# Altium project EasySerial.PrjPcb
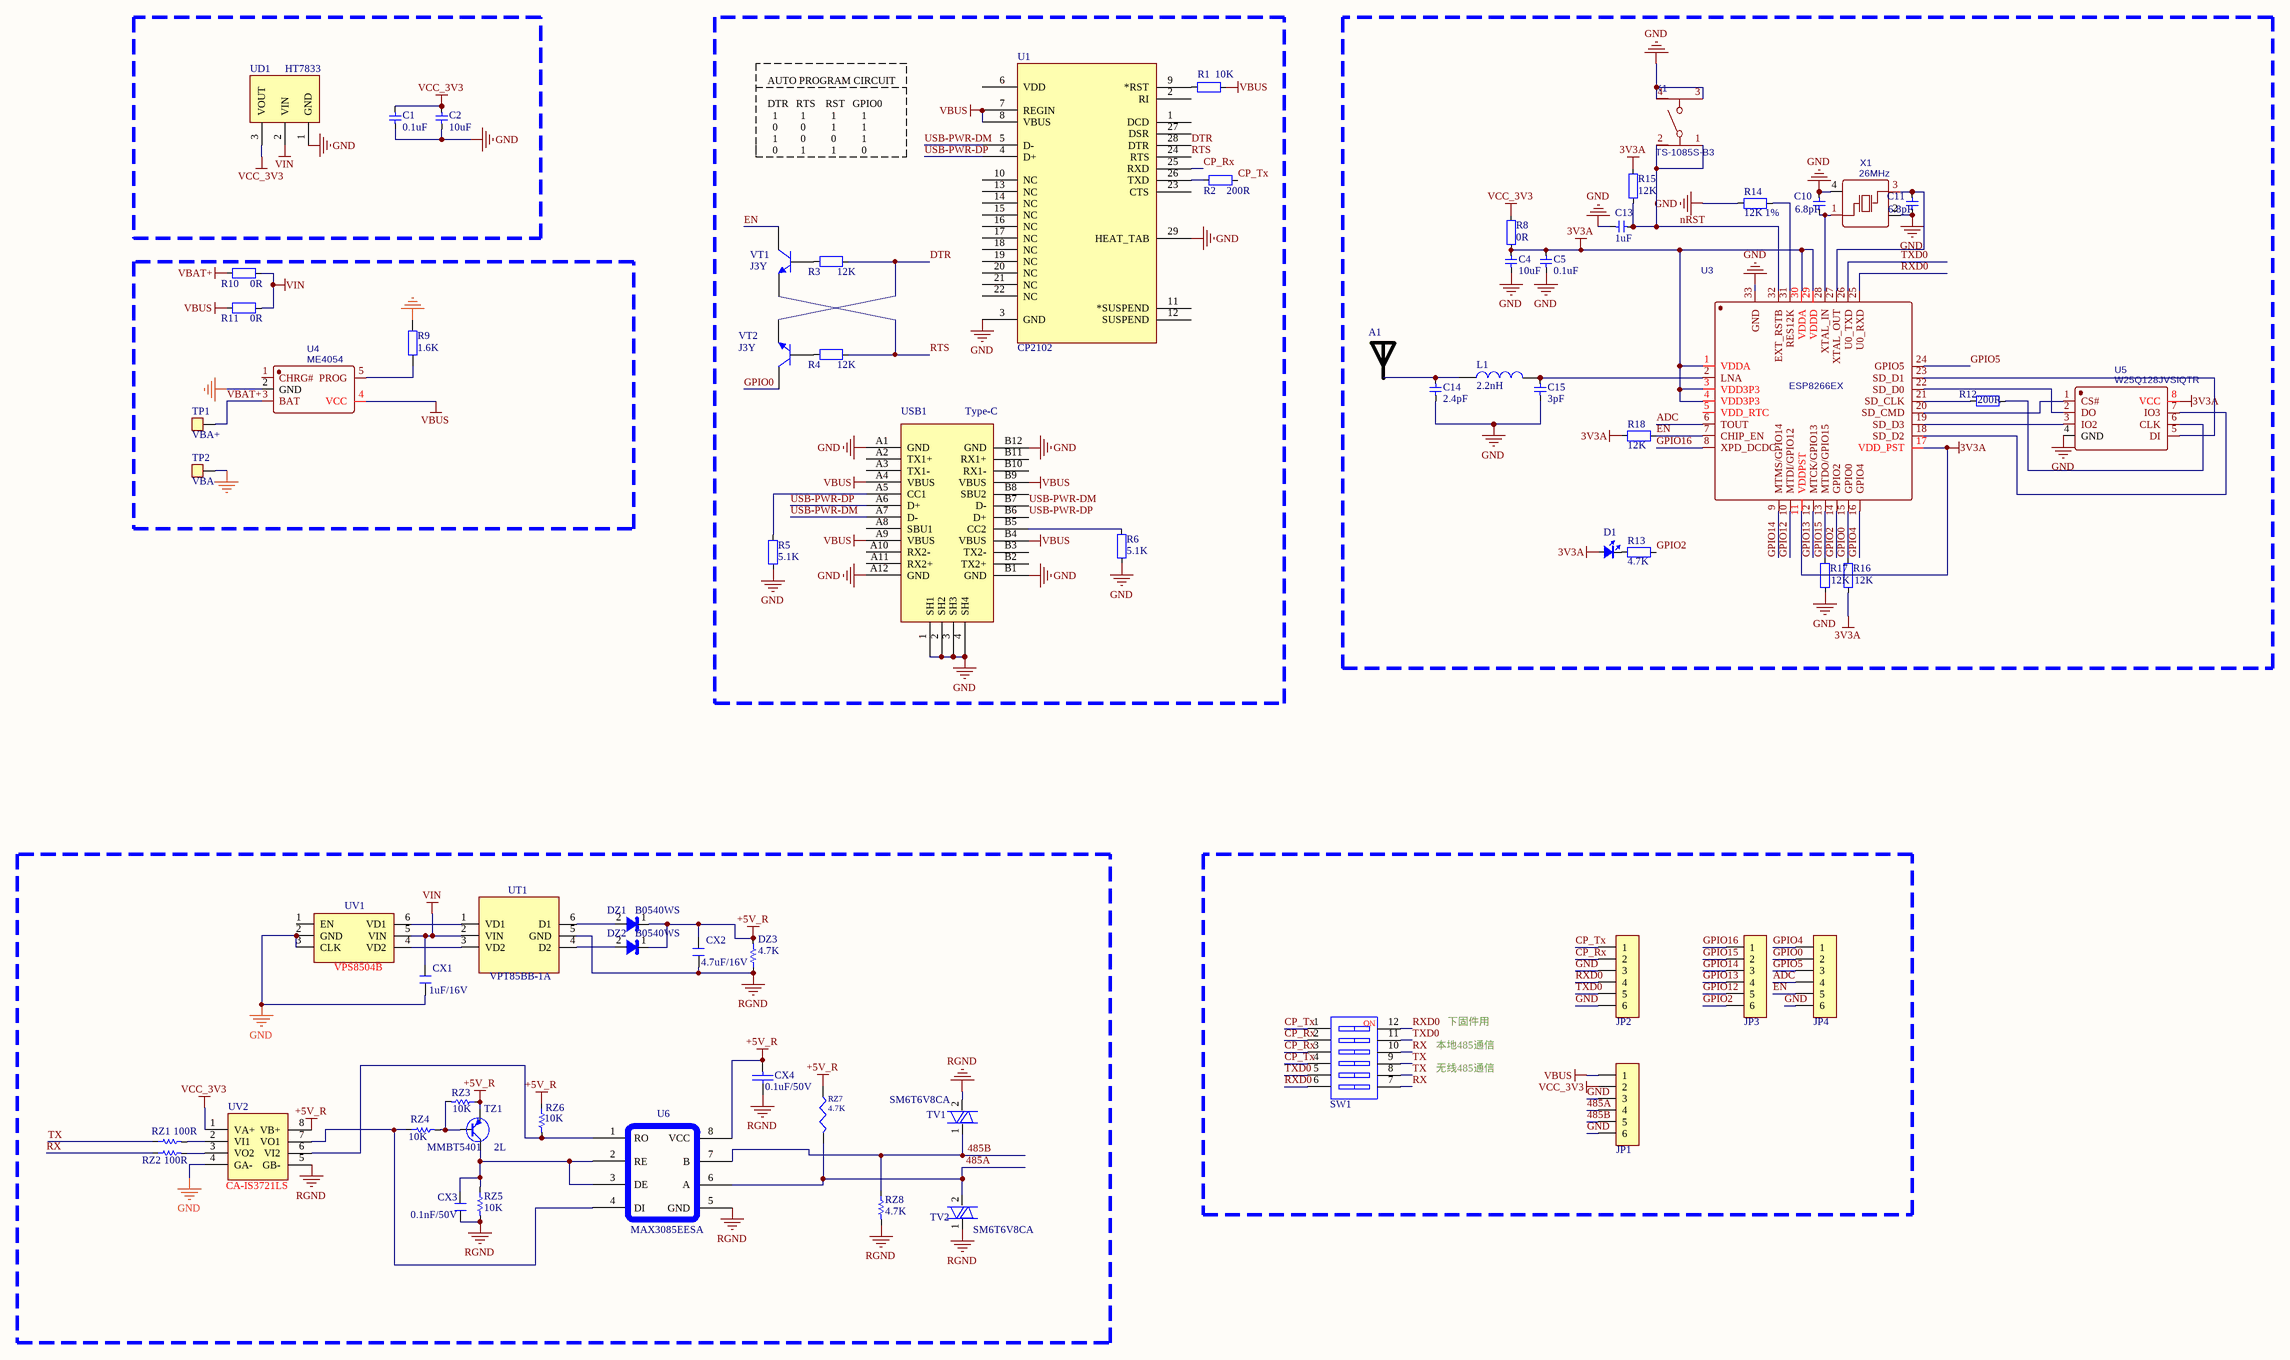
[diagram p0: EasySerial.SchDoc]
1 sheet, 68 parts. Net scope: global (net labels, ports and power ports of the same name join across sheets).
Board file: EasySerial.PcbDoc

## Sheet EasySerial.SchDoc
size A2

### Parts
A1  RAINSUN  [ANT-Rainsun-AN5120]  (value not drawn)
C1  0.1uF  [C 0402]
C2  10uF  [C 0402]
C4  10uF  [C 0402]
C5  0.1uF  [C 0402]
C10  6.8pF  [C 0402]
C11  6.8pF  [C 0402]
C13  1uF  [C 0402]
C14  2.4pF  [C 0402]
C15  3pF  [C 0402]
CX1  1uF/16V  [C 0402]
CX2  4.7uF/16V  [C 0402]
CX3  0.1nF/50V  [C 0402]
CX4  0.1uF/50V  [C 0402]
D1  color?  [LED_0402_RED]  (value not drawn)
DZ1  B0540WS  [SOD-323F]
DZ2  B0540WS  [SOD-323F]
DZ3  4.7K  [R 0402]
JP1  HDR-1X6  [HDR2.54 S-W-6P]  (value not drawn)
JP2  HDR-1X6  [HDR2.54 S-W-6P]  (value not drawn)
JP3  HDR-1X6  [HDR-1X6]  (value not drawn)
JP4  HDR-1X6  [HDR-1X6]  (value not drawn)
K1  TS-1085S-B3  [TS-1085S-B3]
L1  2.2nH  [L 0402]
R1  10K  [R 0402]
R2  200R  [R 0402]
R3  12K  [R 0402]
R4  12K  [R 0402]
R5  5.1K  [R 0402]
R6  5.1K  [R 0402]
R8  0R  [R 0402]
R9  1.6K  [R 0603]
R10  0R  [R 0603]
R11  0R  [R 0603]
R12  200R  [R 0402]
R13  4.7K  [R 0402]
R14  12K 1%  [R 0402]
R15  12K  [R 0402]
R16  12K  [R 0402]
R17  12K  [R 0402]
R18  12K  [R 0402]
RZ1  100R  [R 0402]
RZ2  100R  [R 0402]
RZ3  10K  [R 0402]
RZ4  10K  [R 0402]
RZ5  10K  [R 0402]
RZ6  10K  [R 0402]
RZ7  4.7K  [R 0402]
RZ8  4.7K  [R 0402]
SW1  CSW-6P  [CSW1.27 SMD-6P]  (value not drawn)
TP1  VBA+  [TEST 1.8]
TP2  VBA-  [TEST 1.8]
TV1  SM6T6V8CA  [SMB]
TV2  SM6T6V8CA  [SMB]
TZ1  MMBT5401     2L  [SOT23-3N]
U1  CP2102  [QFN-28]
U3  ESP8266EX  [QFN32 5x5_L]
U4  ME4054  [SOT23-5L]
U5  W25Q128JVSIQTR  [SOP8W_L]
U6  MAX3085EESA  [SOP8_M]
UD1  HT7833  [SOT89_N]
USB1  Type-C  [Type-C]
UT1  VPT85BB-1A  [VPT85BB-1A]
UV1  VPS8504B  [SOT23-6N]
UV2  CA-IS3721LS  [SOP8_N]
VT1  J3Y  [SOT23-3N]
VT2  J3Y  [SOT23-3N]
X1  26MHz  [XTAL-2520]

### Nets
3V3A: C4.2 C5.2 D1.1(A) R8.2 R15.2 R16.1 R18.2 U3.1(VDDA) U3.3(VDD3P3) U3.4(VDD3P3) U3.11(VDDPST) U3.17(VDD_PST) U3.29(VDDD) U3.30(VDDA) U5.8(VCC)
+5V_R: CX2.1 CX4.1 DZ1.1 DZ2.1 DZ3.2 RZ3.1 RZ6.1 RZ7.1 TZ1.2 U6.8(VCC) UV2.8(VB+)
GND: C1.1 C2.1 C4.1 C5.1 C10.2 C11.1 C13.2 C14.1 C15.1 CX1.2 JP1.3 JP1.6 JP2.3 JP2.6 JP4.6 K1.3 K1.4 R5.2 R6.2 R9.1 R14.1 R17.1 TP2.1 U1.3(GND) U1.29(HEAT_TAB) U3.33(GND) U4.2(GND) U5.4(GND) UD1.1(GND) USB1.1(SH1) USB1.2(SH2) USB1.3(SH3) USB1.4(SH4) USB1.A1(GND) USB1.A12(GND) USB1.B1(GND) USB1.B12(GND) UV1.2(GND) UV1.3(CLK) UV2.4(GA-) X1.2(GND) X1.4(GND)
RGND: CX2.2 CX3.1 CX4.2 DZ3.1 RZ5.2 RZ8.2 TV1.2 TV2.1 U6.5(GND) UT1.5(GND) UV2.5(GB-)
VBAT+: R10.2 TP1.1 U4.3(BAT)
VBUS: JP1.1 R1.1 R11.2 U1.7(REGIN) U1.8(VBUS) U4.4(VCC) USB1.A4(VBUS) USB1.A9(VBUS) USB1.B4(VBUS) USB1.B9(VBUS)
VCC_3V3: C1.2 C2.2 JP1.2 R8.1 UD1.3(VOUT) UV2.1(VA+)
VIN: CX1.1 R10.1 R11.1 UD1.2(VIN) UT1.2(VIN) UV1.5(VIN)
485A: JP1.4 RZ7.2 TV2.2 U6.6(A)
485B: JP1.5 RZ8.1 TV1.1 U6.7(B)
ADC: JP4.4 U3.6(TOUT)
CP_Rx: JP2.2 SW1.2 SW1.3 U1.25(RXD)
CP_Tx: JP2.1 R2.1 SW1.1 SW1.4
DTR: R3.1 U1.28(DTR) VT2.2(E)
EN: JP4.5 R18.1 U3.7(CHIP_EN) VT1.3(C)
GPIO0: JP4.2 R16.2 U3.15(GPIO0) VT2.3(C)
GPIO2: JP3.6 R13.2 U3.14(GPIO2)
GPIO4: JP4.1 U3.16(GPIO4)
GPIO5: JP4.3 U3.24(GPIO5)
GPIO12: JP3.5 U3.10(MTDI/GPIO12)
GPIO13: JP3.4 U3.12(MTCK/GPIO13)
GPIO14: JP3.3 U3.9(MTMS/GPIO14)
GPIO15: JP3.2 R17.2 U3.13(MTDO/GPIO15)
GPIO16: JP3.1 U3.8(XPD_DCDC)
nRST: C13.1 K1.1 K1.2 R15.1 U3.32(EXT_RSTB)
RTS: R4.1 U1.24(RTS) VT1.2(E)
RX: RZ2.1 SW1.7 SW1.10
RXD0: JP2.4 SW1.6 SW1.12 U3.25(U0_RXD)
TX: RZ1.1 SW1.8 SW1.9
TXD0: JP2.5 SW1.5 SW1.11 U3.26(U0_TXD)
USB-PWR-DM: U1.5(D-) USB1.A7(D-) USB1.B7(D-)
USB-PWR-DP: U1.4(D+) USB1.A6(D+) USB1.B6(D+)
NetA1_1: A1.1 C14.2 L1.1
NetC10_1: C10.1 U3.28(XTAL_IN) X1.1(OSC1)
NetC11_2: C11.2 U3.27(XTAL_OUT) X1.3(OSC2)
NetC15_2: C15.2 L1.2 U3.2(LNA)
NetCX3_2: CX3.2 RZ5.1 TZ1.3 U6.2(RE) U6.3(DE)
NetD1_2: D1.2(K) R13.1
NetDZ1_2: DZ1.2 UT1.6(D1)
NetDZ2_2: DZ2.2 UT1.4(D2)
NetR1_2: R1.2 U1.9(*RST)
NetR2_2: R2.2 U1.26(TXD)
NetR3_2: R3.2 VT1.1(B)
NetR4_2: R4.2 VT2.1(B)
NetR5_1: R5.1 USB1.A5(CC1)
NetR6_1: R6.1 USB1.B5(CC2)
NetR9_2: R9.2 U4.5(PROG)
NetR12_1: R12.1 U3.21(SD_CLK)
NetR12_2: R12.2 U5.6(CLK)
NetR14_2: R14.2 U3.31(RES12K)
NetRZ1_2: RZ1.2 UV2.2(VI1)
NetRZ2_2: RZ2.2 UV2.3(VO2)
NetRZ3_2: RZ3.2 RZ4.2 TZ1.1
NetRZ4_1: RZ4.1 U6.4(DI) UV2.7(VO1)
NetRZ6_2: RZ6.2 U6.1(RO) UV2.6(VI2)
NetU3_18: U3.18(SD_D2) U5.7(IO3)
NetU3_19: U3.19(SD_D3) U5.3(IO2)
NetU3_20: U3.20(SD_CMD) U5.1(CS#)
NetU3_22: U3.22(SD_D0) U5.2(DO)
NetU3_23: U3.23(SD_D1) U5.5(DI)
NetUT1_1: UT1.1(VD1) UV1.6(VD1)
NetUT1_3: UT1.3(VD2) UV1.4(VD2)

Not connected (* = marked no-connect by the designer): U1 1(DCD) 2(RI) 6(VDD) 10(NC) 11(*SUSPEND) 12(SUSPEND) 13(NC) 14(NC) 15(NC) 16(NC) 17(NC) 18(NC) 19(NC) 20(NC) 21(NC) 22(NC) 23(CTS) 27(DSR); U3 5(VDD_RTC); U4 1(CHRG#); USB1 A2(TX1+) A3(TX1-) A8(SBU1) A10(RX2-) A11(RX2+) B2(TX2+) B3(TX2-) B8(SBU2) B10(RX1-) B11(RX1+); UV1 1(EN)

### Notes on the sheet
- AUTO PROGRAM CIRCUIT
  DTR   RTS    RST   GPIO0
  1         1          1          1
  0         0          1          1
  1         0          0          1
  0         1          1          0
- 本地485通信
- 无线485通信
- 下固件用
- (in symbol CSW-6P) NO

### Library data of the parts
A1 = ANT-Rainsun-AP5120
C1 C2 C4 C5 C10 C11 C13-C15 = 电容-0402: Capacitor; Value: 0.1u
CX1-CX3 = CAP
CX4 = CAP: Capacitor
D1 = LED_0402: LED; Type: 0402; Value: color?
DZ1 DZ2 = DIODE
DZ3 RZ1-RZ6 RZ8 = R-SMD
JP1-JP4 = Header 6: 6P接插件; 版权归属: 源创客; BOM名称: 6P接插件; 学习资源: www.ooocke.com
K1 = TS-1085S-B3: BOM_Manufacturer: Yuandi; Contributor: LCSC; BOM_Supplier: LCSC; BOM_Supplier Part: C498298; BOM_Manufacturer Part: TS-1085S-B3; BOM_JLCPCB Part Class: Extended Part; spicePre: S; spiceSymbolName: TS-1085S-B3
L1 = L: 小功率贴片电感; 版权归属: 源创客; BOM名称: 小功率贴片电感; 学习资源: www.ooocke.com
R1-R6 R8 R10-R18 = 电阻-0402: Resistor; Value: 22R
R9 = Res2: Resistor; Published: 8-Jun-2000; LatestRevisionDate: 17-Jul-2002; LatestRevisionNote: Re-released for DXP Platform.; PackageReference: AXIAL-0.4; Publisher: Altium Limited; PackageDescription: Axial Device, Thru-Hole; 2 Leads; 0.4 in Pin Spacing
RZ7 = RES1
SW1 = CSW-6P: 6路编码开关; 版权归属: 源创客; BOM名称: 6路编码开关; 学习资源: www.ooocke.com
TP1 TP2 = TEST_D: 测试点; 版权归属: 源创客; BOM名称: 测试点; 学习资源: www.ooocke.com
TV1 TV2 = ZD1: PCB DECAL: SOD(D0-214AA); CODE: 05G006801-0N; DESCRIBE: SM6T6V8CA Vbr=6.8V SMB; VALUE: SM6T6V8CA
TZ1 = PNP_R
U1 = CP2102: USB转TTL; PART DESC: SINGLE-CHIP USB TO UART BRIDGE, QFN28, RoHS.; MFG #1: SILICON LABS; PART NUMBER: CP2102; Value: Value; RefDes: RefDes; Type: DEV
U3 = ESP8266EX: BOM_Manufacturer: ESPRESSIF; BOM_Supplier: LCSC; BOM_Manufacturer Part: ESP8266EX; BOM_Supplier Part: C77967; BOM_JLCPCB Part Class: Extended Part; spicePre: U; spiceSymbolName: ESP8266EX
U4 = SD8054: BOM_Manufacturer: SHOUDING; Contributor: LCSC; BOM_Supplier: LCSC; BOM_Supplier Part: C521413; BOM_Manufacturer Part: SD8054; BOM_JLCPCB Part Class: Extended Part; spicePre: U; spiceSymbolName: SD8054
U5 = W25Q128JVSIQTR: BOM_Manufacturer: WINBOND; BOM_Supplier: LCSC; BOM_Manufacturer Part: W25Q128JVSIQTR; BOM_Supplier Part: C97521; BOM_JLCPCB Part Class: Basic Part; spicePre: U; spiceSymbolName: W25Q128JVSIQTR
U6 = MAX485
UD1 = HT75XX: LDO
USB1 = USB-Type-C-TOP
UT1 = T-SMD: 源特推挽变压器
UV1 = VPS8504: 源特微功率隔离电源专用芯片
UV2 = CA-IS3721LS: 上海川土微电子隔离数字芯片
VT1 VT2 = SMT_TRIODE_NPN: Surface mount NPN transistor, package SOT-23
X1 = 30MHz: BOM_Manufacturer: NDK; BOM_Manufacturer Part: NX3225SA-30M; nameAlias: Frequency; Contributor: LCSC; BOM_Supplier: LCSC; BOM_Supplier Part: C139739; BOM_JLCPCB Part Class: Extended Part; spicePre: X; spiceSymbolName: NX3225SA-30M